# Altium schematic sheet BUCK_Module_2596_ADJ.SchDoc
size A4
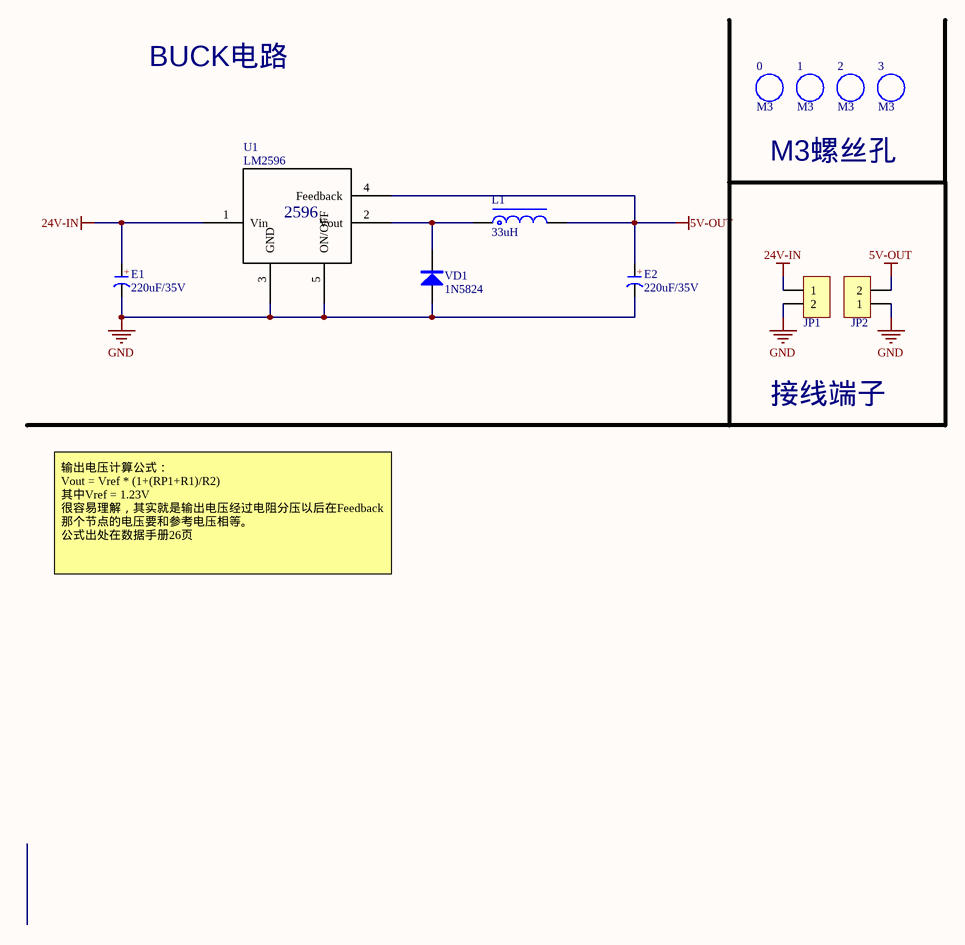
[diagram p0: BUCK_Module_2596_ADJ.SchDoc]

## Parts
0  M3  [M3 125X200]
1  M3  [M3 125X200]
2  M3  [M3 125X200]
3  M3  [M3 125X200]
E1  220uF/35V  [CM D(6.3*5.4)]
E2  220uF/35V  [CM D(6.3*7.7)]
JP1  HDR-1X2  [KF301-2P]  (value not drawn)
JP2  HDR-1X2  [KF301-2P]  (value not drawn)
L1  33uH  [CDRH127]
U1  LM2596  [LM2596]
VD1  1N5824  [SMB]

## Nets
5V-OUT: E2.1(A) JP2.2 L1.2 U1.4(Feedback)
24V-IN: E1.1(A) JP1.1 U1.1(Vin)
GND: E1.2(K) E2.2(K) JP1.2 JP2.1 U1.3(GND) U1.5(ON/OFF) VD1.1(A)
NetL1_1: L1.1 U1.2(Vout) VD1.2(K)

## Notes on the sheet
- BUCK电路
- M3螺丝孔
- 接线端子
- 输出电压计算公式：
  Vout = Vref * (1+(RP1+R1)/R2)
  其中Vref = 1.23V
  很容易理解，其实就是输出电压经过电阻分压以后在Feedback那个节点的电压要和参考电压相等。
  公式出处在数据手册26页
- (in symbol C-CM) +
- (in symbol LM2596) 2596

## Library data of the parts
0-3 = M3: 铜柱孔; 版权归属: 源创客; BOM名称: 铜柱孔; 学习资源: www.ooocke.com
E1 E2 = C-CM: 贴片电解电容; 版权归属: 源创客; BOM名称: 贴片电解电容; 学习资源: www.ooocke.com
JP1 JP2 = Header 2: 2P接插件; 版权归属: 源创客; BOM名称: 2P接插件; 学习资源: www.ooocke.com
L1 = L-CDRH: 功率屏蔽电感; 版权归属: 源创客; BOM名称: 功率屏蔽电感; 学习资源: www.ooocke.com
VD1 = SS24: 肖特基二极管; 版权归属: 源创客; 属性: 40V/2A; BOM名称: 肖特基二极管; 学习资源: www.ooocke.com